# EAGLE schematic NSL_APRS_Tracker (EAGLE 6.3)
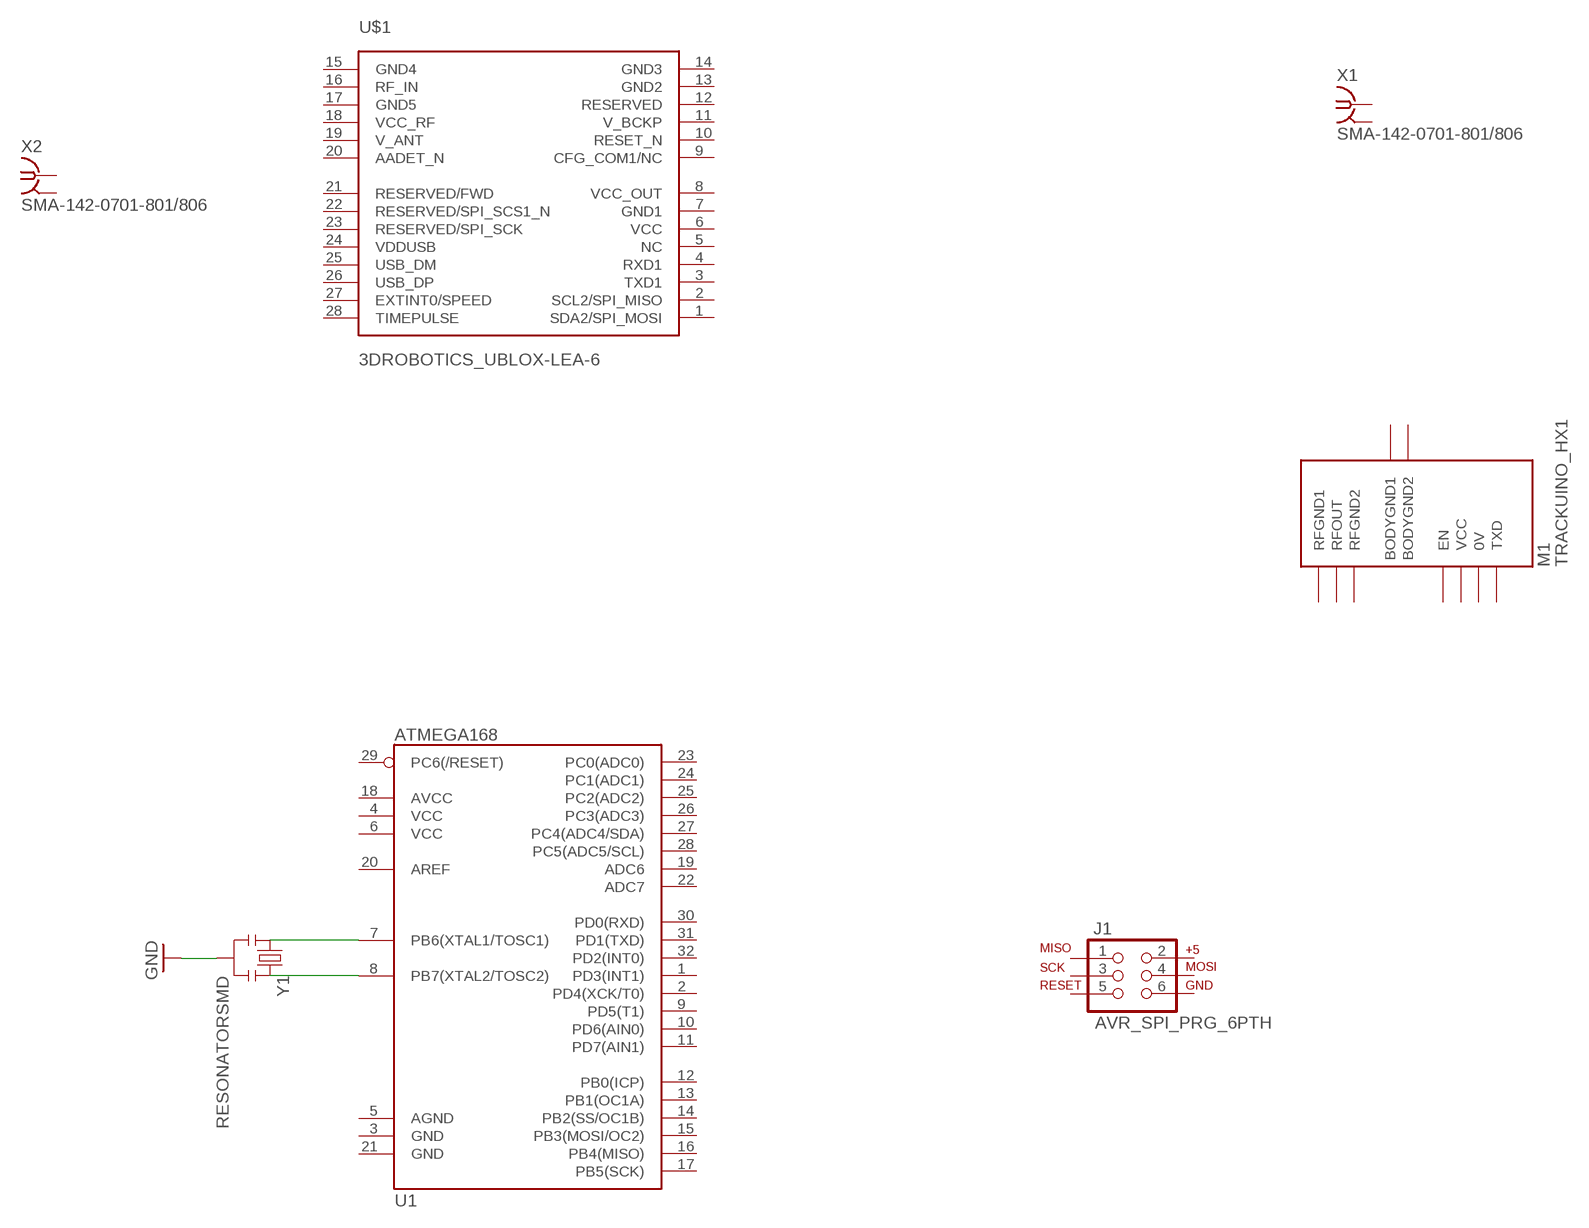
[diagram p0: schematic, sheet 1]

## Parts
J1  AVR_SPI_PRG_6PTH  [2X3]
M1  TRACKUINO_HX1  [TRACKUINO_HX1]
U1  ATMEGA168  [TQFP32-08]
U$1  3DROBOTICS_UBLOX-LEA-6  [3DROBOTICS_UBLOX-LEA-6]
X1  SMA-142-0701-801/806  [J502-ND-142-0701-801/806]
X2  SMA-142-0701-801/806  [J502-ND-142-0701-801/806]
Y1  RESONATORSMD  [RESONATOR-SMD]

## Nets
GND: Y1.2
N$1: U1.7(PB6(XTAL1/TOSC1)) Y1.1
N$2: U1.8(PB7(XTAL2/TOSC2)) Y1.3
Unconnected: J1.1 J1.2 J1.3 J1.4 J1.5 J1.6 M1.0V M1.BODYGND1 M1.BODYGND2 M1.EN M1.RFGND1 M1.RFGND2 M1.RFOUT M1.TXD M1.VCC U1.1(PD3(INT1)) U1.2(PD4(XCK/T0)) U1.3(GND) U1.4(VCC) U1.5(AGND) U1.6(VCC) U1.9(PD5(T1)) U1.10(PD6(AIN0)) U1.11(PD7(AIN1)) U1.12(PB0(ICP)) U1.13(PB1(OC1A)) U1.14(PB2(SS/OC1B)) U1.15(PB3(MOSI/OC2)) U1.16(PB4(MISO)) U1.17(PB5(SCK)) U1.18(AVCC) U1.19(ADC6) U1.20(AREF) U1.21(GND) U1.22(ADC7) U1.23(PC0(ADC0)) U1.24(PC1(ADC1)) U1.25(PC2(ADC2)) U1.26(PC3(ADC3)) U1.27(PC4(ADC4/SDA)) U1.28(PC5(ADC5/SCL)) U1.29(PC6(/RESET)) U1.30(PD0(RXD)) U1.31(PD1(TXD)) U1.32(PD2(INT0)) U$1.1(SDA2/SPI_MOSI) U$1.2(SCL2/SPI_MISO) U$1.3(TXD1) U$1.4(RXD1) U$1.5(NC) U$1.6(VCC) U$1.7(GND1) U$1.8(VCC_OUT) U$1.9(CFG_COM1/NC) U$1.10(RESET_N) U$1.11(V_BCKP) U$1.12(RESERVED) U$1.13(GND2) U$1.14(GND3) U$1.15(GND4) U$1.16(RF_IN) U$1.17(GND5) U$1.18(VCC_RF) U$1.19(V_ANT) U$1.20(AADET_N) U$1.21(RESERVED/FWD) U$1.22(RESERVED/SPI_SCS1_N) U$1.23(RESERVED/SPI_SCK) U$1.24(VDDUSB) U$1.25(USB_DM) U$1.26(USB_DP) U$1.27(EXTINT0/SPEED) U$1.28(TIMEPULSE) X1.1 X2.1

## Power pins joined to a net without a drawn wire
GND: X1.G@1(GND) X1.G@2(GND) X1.G@3(GND) X1.G@4(GND) X2.G@1(GND) X2.G@2(GND) X2.G@3(GND) X2.G@4(GND)

## Library data of the parts
J1 = SparkFun:AVR_SPI_PRG_6: AVR ISP 6 Pin This is the reduced ISP connector for AVR programming. Common on Arduino. This footprint will take up less PCB space and can be used with a 10-pin to 6-pin adapter such as SKU: BOB-08508
M1 = trackuino-shield:TRACKUINO_HX1
U1 = SparkFun:ATMEGA168
U$1 = 3DR-GPS-LEA6-JST-v11-RELEASE:3DROBOTICS_UBLOX-LEA-6: u-blox LEA-6 GPS Module The LEA-6 module series is a family of stand-alone GPS receivers featuring the high performance u-blox 6 positioning engine. These versatile receivers feature an extensive and flexible range of functionality, connectivity and cost savings options. LEA-6 modules maintain the industry standard 17.0 x 22.4mm form factor of the LEA-5 series and have been designed to allow simple migration. Their ease of integration results in reduced costs and short time to market for a wide range of automotive, consumer and industrial applications. The 50-channel u-blox 6 positioning engine boasts a Time-To-First-Fix (TTFF) of under 1 second. The dedicated acquisition engine, with over 2 million correlators, is capable of massive parallel time/frequency space searches, enabling it to find satellites instantly. Innovative design and technology suppresses interference sources and mitigates multipath effects, giving LEA-6 GPS receivers excellent navigation performance even in the most challenging environments.; DATASHEET: http://www.u-blox.com/images/downloads/Product_Docs/LEA-6_DataSheet_%28GPS.G6-HW-09004%29.pdf; LINK: http://www.u-blox.com/en/gps-modules/pvt-modules/lea-6-family.html; MFGPN: LEA-6
X1 X2 = con-coax:SMA-: SMA 50 Ohm End Launch Jack Receptacle - Round Contact Johnson Components Source: www.johnsoncomponents.com .. J502-ND.pdf; MF: JOHNSON COMPONENTS; MPN: 142-0701-801; OC_FARNELL: 1608592; OC_NEWARK: 90F2624
Y1 = SparkFun:RESONATOR: Resonator Small SMD resonator. This is the itty bitty 10/20MHz resonators with built in caps. CSTCE10M0G55 and CSTCE20M0V53. Footprint has been reviewed closely but hasn't been tested yet.